# Altium schematic sheet PWR_GEN.SchDoc
size A4; DocumentNumber: 1; SheetNumber: 4; SheetTotal: 6
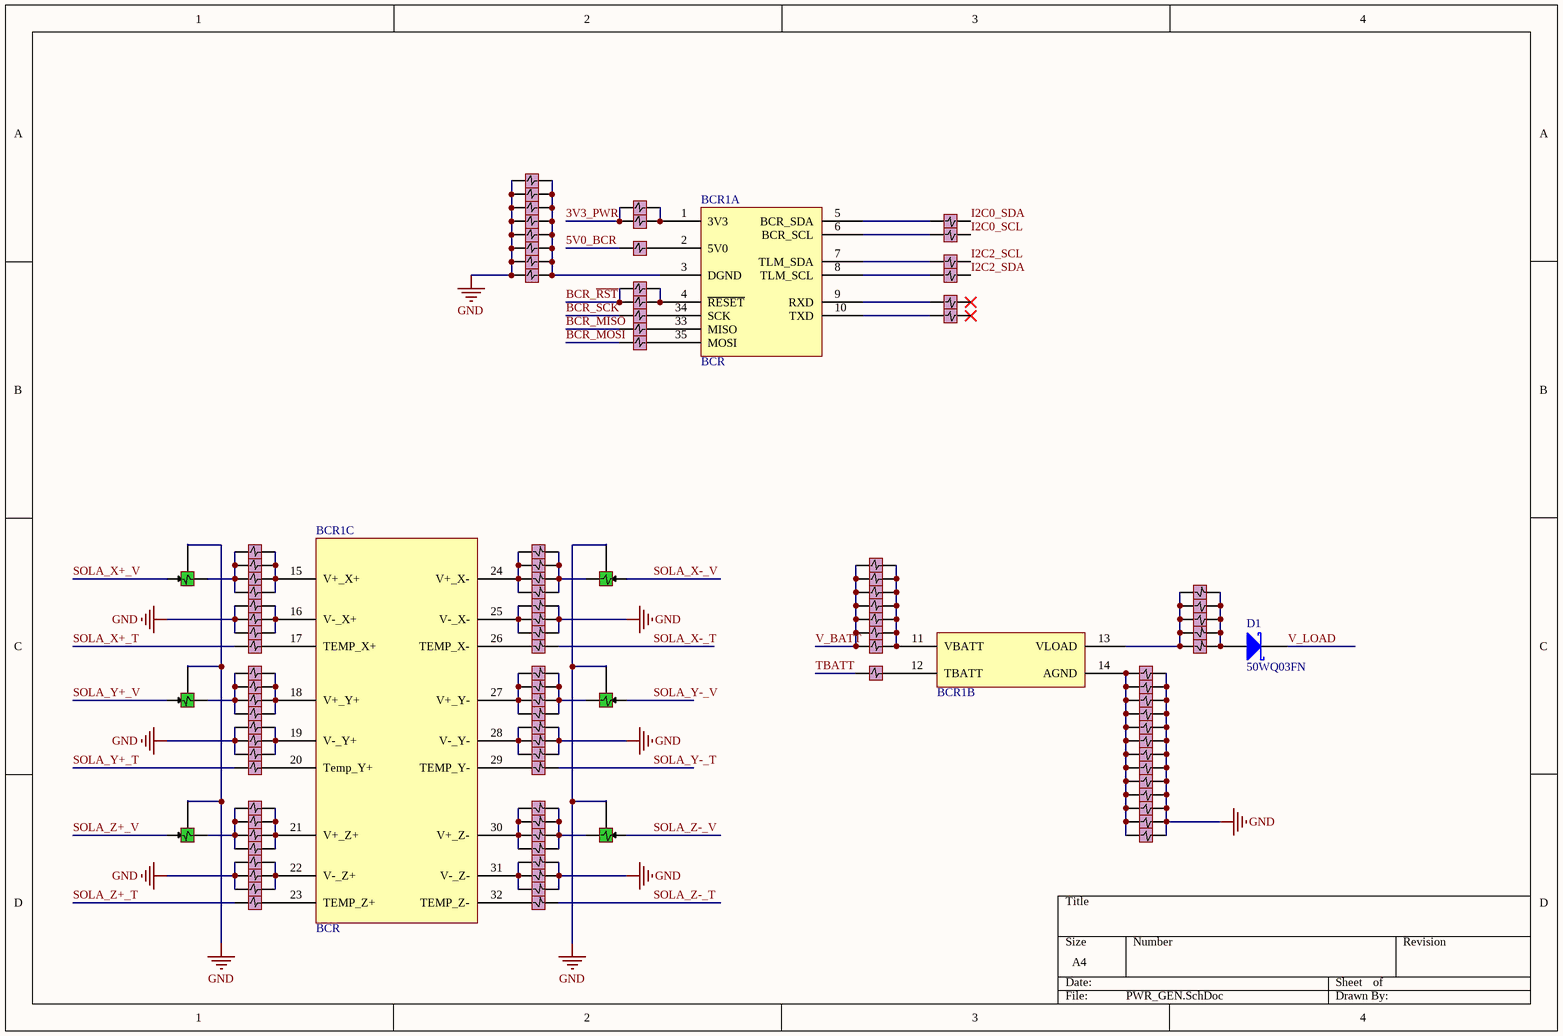
[diagram p0: PWR_GEN.SchDoc]

## Parts
BCR1  BCR  [BCR_FLATSAT_BOARD]  (parts A,B,C of 3)
D1  50WQ03FN  [TO229P990X238-3N]
F15  FilterSola  [FILTERSOLA]  (value not drawn)
F16  FilterSola  [FILTERSOLA]  (value not drawn)
F17  FilterSola  [FILTERSOLA]  (value not drawn)
F18  FilterSola  [FILTERSOLA]  (value not drawn)
F19  FilterSola  [FILTERSOLA]  (value not drawn)
F20  FilterSola  [FILTERSOLA]  (value not drawn)
P337  Jumper_Filter  [Jumper_filter]  (value not drawn)
P338  Jumper_Filter  [Jumper_filter]  (value not drawn)
P339  Jumper_Filter  [Jumper_filter]  (value not drawn)
P340  Jumper_Filter  [Jumper_filter]  (value not drawn)
P341  Jumper_Filter  [Jumper_filter]  (value not drawn)
P342  Jumper_Filter  [Jumper_filter]  (value not drawn)
P343  Jumper_Filter  [Jumper_filter]  (value not drawn)
P344  Jumper_Filter  [Jumper_filter]  (value not drawn)
P345  Jumper_Filter  [Jumper_filter]  (value not drawn)
P346  Jumper_Filter  [Jumper_filter]  (value not drawn)
P347  Jumper_Filter  [Jumper_filter]  (value not drawn)
P348  Jumper_Filter  [Jumper_filter]  (value not drawn)
P349  Jumper_Filter  [Jumper_filter]  (value not drawn)
P350  Jumper_Filter  [Jumper_filter]  (value not drawn)
P351  Jumper_Filter  [Jumper_filter]  (value not drawn)
P352  Jumper_Filter  [Jumper_filter]  (value not drawn)
P353  Jumper_Filter  [Jumper_filter]  (value not drawn)
P354  Jumper_Filter  [Jumper_filter]  (value not drawn)
P355  Jumper_Filter  [Jumper_filter]  (value not drawn)
P356  Jumper_Filter  [Jumper_filter]  (value not drawn)
P357  Jumper_Filter  [Jumper_filter]  (value not drawn)
P358  Jumper_Filter  [Jumper_filter]  (value not drawn)
P359  Jumper_Filter  [Jumper_filter]  (value not drawn)
P360  Jumper_Filter  [Jumper_filter]  (value not drawn)
P361  Jumper_Filter  [Jumper_filter]  (value not drawn)
P362  Jumper_Filter  [Jumper_filter]  (value not drawn)
P363  Jumper_Filter  [Jumper_filter]  (value not drawn)
P364  Jumper_Filter  [Jumper_filter]  (value not drawn)
P365  Jumper_Filter  [Jumper_filter]  (value not drawn)
P366  Jumper_Filter  [Jumper_filter]  (value not drawn)
P367  Jumper_Filter  [Jumper_filter]  (value not drawn)
P368  Jumper_Filter  [Jumper_filter]  (value not drawn)
P369  Jumper_Filter  [Jumper_filter]  (value not drawn)
P370  Jumper_Filter  [Jumper_filter]  (value not drawn)
P371  Jumper_Filter  [Jumper_filter]  (value not drawn)
P372  Jumper_Filter  [Jumper_filter]  (value not drawn)
P373  Jumper_Filter  [Jumper_filter]  (value not drawn)
P374  Jumper_Filter  [Jumper_filter]  (value not drawn)
P375  Jumper_Filter  [Jumper_filter]  (value not drawn)
P376  Jumper_Filter  [Jumper_filter]  (value not drawn)
P377  Jumper_Filter  [Jumper_filter]  (value not drawn)
P378  Jumper_Filter  [Jumper_filter]  (value not drawn)
P379  Jumper_Filter  [Jumper_filter]  (value not drawn)
P380  Jumper_Filter  [Jumper_filter]  (value not drawn)
P381  Jumper_Filter  [Jumper_filter]  (value not drawn)
P382  Jumper_Filter  [Jumper_filter]  (value not drawn)
P383  Jumper_Filter  [Jumper_filter]  (value not drawn)
P384  Jumper_Filter  [Jumper_filter]  (value not drawn)
P385  Jumper_Filter  [Jumper_filter]  (value not drawn)
P386  Jumper_Filter  [Jumper_filter]  (value not drawn)
P387  Jumper_Filter  [Jumper_filter]  (value not drawn)
P388  Jumper_Filter  [Jumper_filter]  (value not drawn)
P389  Jumper_Filter  [Jumper_filter]  (value not drawn)
P390  Jumper_Filter  [Jumper_filter]  (value not drawn)
P391  Jumper_Filter  [Jumper_filter]  (value not drawn)
P392  Jumper_Filter  [Jumper_filter]  (value not drawn)
P393  Jumper_Filter  [Jumper_filter]  (value not drawn)
P394  Jumper_Filter  [Jumper_filter]  (value not drawn)
P395  Jumper_Filter  [Jumper_filter]  (value not drawn)
P396  Jumper_Filter  [Jumper_filter]  (value not drawn)
P397  Jumper_Filter  [Jumper_filter]  (value not drawn)
P398  Jumper_Filter  [Jumper_filter]  (value not drawn)
P399  Jumper_Filter  [Jumper_filter]  (value not drawn)
P400  Jumper_Filter  [Jumper_filter]  (value not drawn)
P401  Jumper_Filter  [Jumper_filter]  (value not drawn)
P402  Jumper_Filter  [Jumper_filter]  (value not drawn)
P403  Jumper_Filter  [Jumper_filter]  (value not drawn)
P404  Jumper_Filter  [Jumper_filter]  (value not drawn)
P405  Jumper_Filter  [Jumper_filter]  (value not drawn)
P406  Jumper_Filter  [Jumper_filter]  (value not drawn)
P407  Jumper_Filter  [Jumper_filter]  (value not drawn)
P408  Jumper_Filter  [Jumper_filter]  (value not drawn)
P409  Jumper_Filter  [Jumper_filter]  (value not drawn)
P410  Jumper_Filter  [Jumper_filter]  (value not drawn)
P411  Jumper_Filter  [Jumper_filter]  (value not drawn)
P412  Jumper_Filter  [Jumper_filter]  (value not drawn)
P413  Jumper_Filter  [Jumper_filter]  (value not drawn)
P414  Jumper_Filter  [Jumper_filter]  (value not drawn)
P415  Jumper_Filter  [Jumper_filter]  (value not drawn)
P416  Jumper_Filter  [Jumper_filter]  (value not drawn)
P417  Jumper_Filter  [Jumper_filter]  (value not drawn)
P418  Jumper_Filter  [Jumper_filter]  (value not drawn)
P419  Jumper_Filter  [Jumper_filter]  (value not drawn)
P420  Jumper_Filter  [Jumper_filter]  (value not drawn)
P421  Jumper_Filter  [Jumper_filter]  (value not drawn)
P422  Jumper_Filter  [Jumper_filter]  (value not drawn)
P423  Jumper_Filter  [Jumper_filter]  (value not drawn)
P424  Jumper_Filter  [Jumper_filter]  (value not drawn)
P425  Jumper_Filter  [Jumper_filter]  (value not drawn)
P426  Jumper_Filter  [Jumper_filter]  (value not drawn)
P427  Jumper_Filter  [Jumper_filter]  (value not drawn)
P428  Jumper_Filter  [Jumper_filter]  (value not drawn)
P429  Jumper_Filter  [Jumper_filter]  (value not drawn)
P430  Jumper_Filter  [Jumper_filter]  (value not drawn)
P431  Jumper_Filter  [Jumper_filter]  (value not drawn)
P432  Jumper_Filter  [Jumper_filter]  (value not drawn)

## Nets
GND: F15.3 F16.3 F17.3 F18.3 F19.3 F20.3 P337.3 P338.3 P339.3 P340.3 P341.1 P341.3 P342.1 P342.3 P343.1 P343.3 P344.3 P345.3 P346.3 P347.3 P348.3 P349.1 P349.3 P350.1 P350.3 P351.1 P351.3 P352.3 P353.3 P354.3 P355.3 P356.3 P357.1 P357.3 P358.1 P358.3 P359.1 P359.3 P360.3 P361.1 P361.3 P362.1 P362.3 P363.1 P363.3 P364.1 P364.3 P365.1 P365.3 P366.1 P366.3 P367.1 P367.3 P368.1 P368.3 P369.3 P370.3 P371.3 P372.3 P373.1 P373.3 P374.1 P374.3 P375.1 P375.3 P376.3 P377.3 P378.3 P379.3 P380.3 P381.1 P381.3 P382.1 P382.3 P383.1 P383.3 P384.3 P385.3 P386.3 P387.3 P388.3 P389.1 P389.3 P390.1 P390.3 P391.1 P391.3 P392.3 P393.3 P394.3 P395.3 P396.3 P397.3 P398.3 P399.3 P400.3 P401.3 P402.3 P403.3 P404.3 P405.3 P406.3 P407.3 P408.3 P409.3 P410.3 P411.3 P412.3 P413.3 P414.3 P415.1 P415.3 P416.1 P416.3 P417.1 P417.3 P418.1 P418.3 P419.1 P419.3 P420.1 P420.3 P421.1 P421.3 P422.1 P422.3 P423.1 P423.3 P424.1 P424.3 P425.1 P425.3 P426.1 P426.3 P427.1 P427.3 P428.3 P429.3 P430.3 P431.3 P432.3
3V3_PWR: P393.1 P394.1
5V0_BCR: P395.1
BCR_MISO: P398.1
BCR_MOSI: P400.1
BCR_~{RST}: P396.1 P397.1
BCR_SCK: P399.1
I2C0_SCL: P410.1
I2C0_SDA: P409.1
I2C2_SCL: P411.1
I2C2_SDA: P412.1
SOLA_X+_T: P344.1
SOLA_X+_V: F15.1
SOLA_X-_T: P376.1
SOLA_X-_V: F18.1
SOLA_Y+_T: P352.1
SOLA_Y+_V: F16.1
SOLA_Y-_T: P384.1
SOLA_Y-_V: F19.1
SOLA_Z+_T: P360.1
SOLA_Z+_V: F17.1
SOLA_Z-_T: P392.1
SOLA_Z-_V: F20.1
TBATT: P408.1
V_BATT: P401.1 P402.1 P403.1 P404.1 P405.1 P406.1 P407.1
V_LOAD: D1.2(K)
NetBCR1_1: BCR1.1(3V3) P393.2 P394.2
NetBCR1_2: BCR1.2(5V0) P395.2
NetBCR1_3: BCR1.3(DGND) P361.2 P362.2 P363.2 P364.2 P365.2 P366.2 P367.2 P368.2
NetBCR1_4: BCR1.4(~{RESET}) P396.2 P397.2
NetBCR1_5: BCR1.5(BCR_SDA) P409.2
NetBCR1_6: BCR1.6(BCR_SCL) P410.2
NetBCR1_7: BCR1.7(TLM_SDA) P411.2
NetBCR1_8: BCR1.8(TLM_SCL) P412.2
NetBCR1_9: BCR1.9(RXD) P413.2
NetBCR1_10: BCR1.10(TXD) P414.2
NetBCR1_11: BCR1.11(VBATT) P401.2 P402.2 P403.2 P404.2 P405.2 P406.2 P407.2
NetBCR1_12: BCR1.12(TBATT) P408.2
NetBCR1_13: BCR1.13(VLOAD) P428.2 P429.2 P430.2 P431.2 P432.2
NetBCR1_14: BCR1.14(AGND) P415.2 P416.2 P417.2 P418.2 P419.2 P420.2 P421.2 P422.2 P423.2 P424.2 P425.2 P426.2 P427.2
NetBCR1_15: BCR1.15(V+_X+) P337.2 P338.2 P339.2 P340.2
NetBCR1_16: BCR1.16(V-_X+) P341.2 P342.2 P343.2
NetBCR1_17: BCR1.17(TEMP_X+) P344.2
NetBCR1_18: BCR1.18(V+_Y+) P345.2 P346.2 P347.2 P348.2
NetBCR1_19: BCR1.19(V-_Y+) P349.2 P350.2 P351.2
NetBCR1_20: BCR1.20(Temp_Y+) P352.2
NetBCR1_21: BCR1.21(V+_Z+) P353.2 P354.2 P355.2 P356.2
NetBCR1_22: BCR1.22(V-_Z+) P357.2 P358.2 P359.2
NetBCR1_23: BCR1.23(TEMP_Z+) P360.2
NetBCR1_24: BCR1.24(V+_X-) P369.2 P370.2 P371.2 P372.2
NetBCR1_25: BCR1.25(V-_X-) P373.2 P374.2 P375.2
NetBCR1_26: BCR1.26(TEMP_X-) P376.2
NetBCR1_27: BCR1.27(V+_Y-) P377.2 P378.2 P379.2 P380.2
NetBCR1_28: BCR1.28(V-_Y-) P381.2 P382.2 P383.2
NetBCR1_29: BCR1.29(TEMP_Y-) P384.2
NetBCR1_30: BCR1.30(V+_Z-) P385.2 P386.2 P387.2 P388.2
NetBCR1_31: BCR1.31(V-_Z-) P389.2 P390.2 P391.2
NetBCR1_32: BCR1.32(TEMP_Z-) P392.2
NetBCR1_33: BCR1.33(MISO) P398.2
NetBCR1_34: BCR1.34(SCK) P399.2
NetBCR1_35: BCR1.35(MOSI) P400.2
NetD1_1: D1.1(A) P428.1 P429.1 P430.1 P431.1 P432.1
NetF15_2: F15.2 P337.1 P338.1 P339.1 P340.1
NetF16_2: F16.2 P345.1 P346.1 P347.1 P348.1
NetF17_2: F17.2 P353.1 P354.1 P355.1 P356.1
NetF18_2: F18.2 P369.1 P370.1 P371.1 P372.1
NetF19_2: F19.2 P377.1 P378.1 P379.1 P380.1
NetF20_2: F20.2 P385.1 P386.1 P387.1 P388.1

Not connected (* = marked no-connect by the designer): P413 1*; P414 1*

## Library data of the parts
D1 = D Schottky: Schottky Diode; Published: 8-Jun-2000; LatestRevisionDate: 17-Jul-2002; LatestRevisionNote: Re-released for DXP Platform.; PackageReference: SMB; Publisher: Altium Limited; PackageDescription: DO-214-AA/SMB; 2 C-Bend Leads; Body 5.3 x 3.6 mm, inc. leads (LxW); Code_JEDEC: DO-214-AA